# Altium schematic sheet connectors.SchDoc
size A
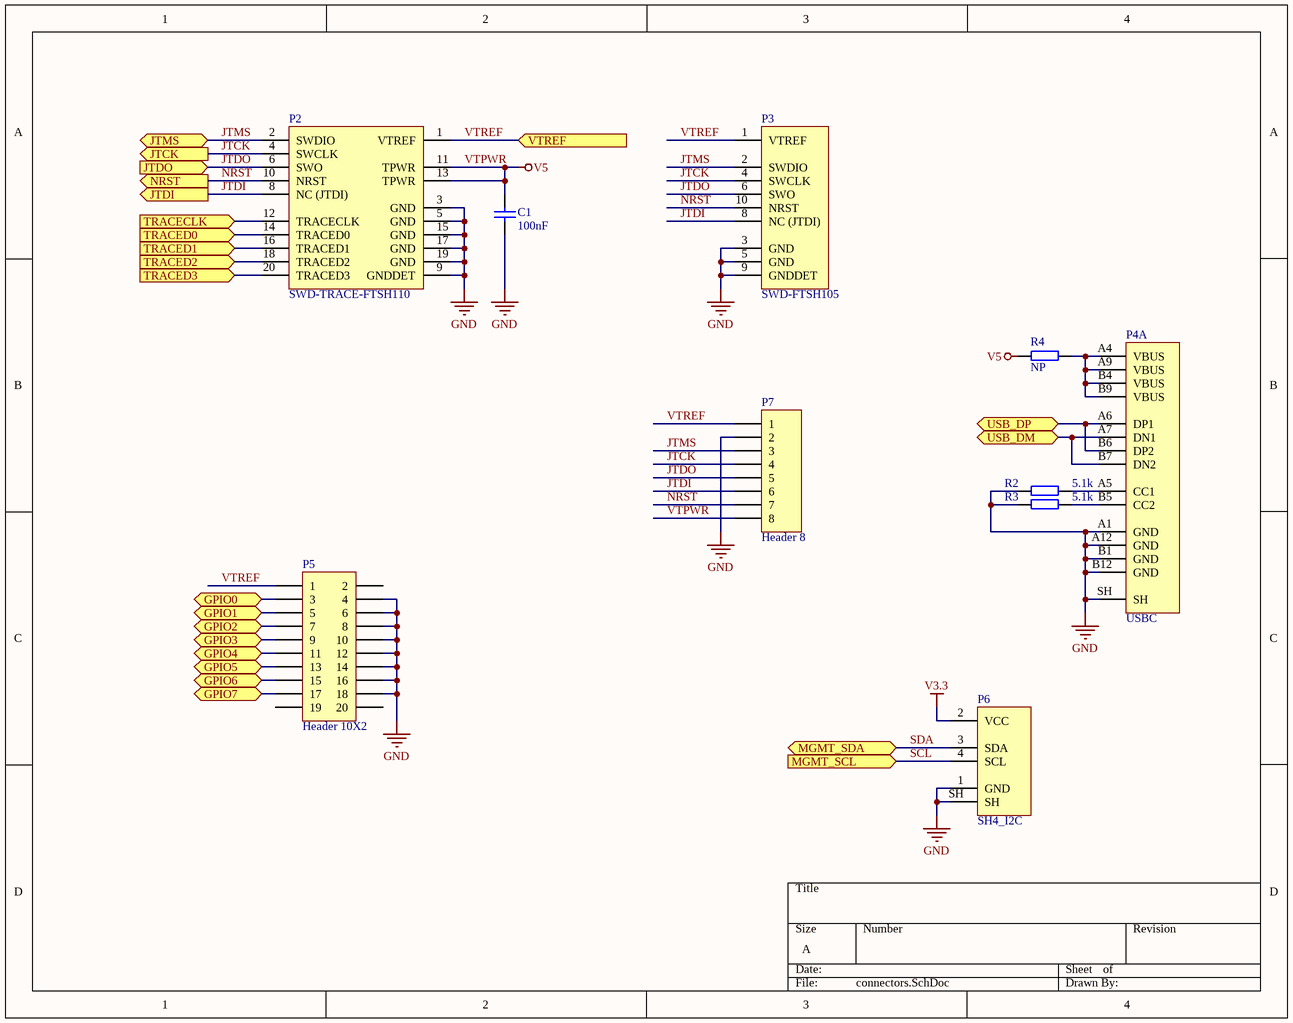
[diagram p0: connectors.SchDoc]

## Parts
C1  100nF  [0402]
P2  SWD-TRACE-FTSH110  [FTSH110]
P3  SWD-FTSH105  [FTSH105]
P4  USBC  [U262-161N-4BVC11]  (part A of 2)
P5  Header 10X2  [HDR2X10]
P6  SH4_I2C  [SM04B]
P7  Header 8  [HDR1X8]
R2  5.1k  [0402]
R3  5.1k  [0402]
R4  NP  [0402]

## Ports
GPIO0 (bidir), GPIO1 (bidir), GPIO2 (bidir), GPIO3 (bidir), GPIO4 (bidir), GPIO5 (bidir), GPIO6 (bidir), GPIO7 (bidir), JTCK (out), JTDI (out), JTDO (in), JTMS (bidir), MGMT_SCL (in), MGMT_SDA (bidir), NRST (out), TRACECLK (in), TRACED0 (in), TRACED1 (in), TRACED2 (in), TRACED3 (in), USB_DM, USB_DP, VTREF (in)

## Nets
GND: C1.1 P2.3(GND) P2.5(GND) P2.9(GNDDET) P2.15(GND) P2.17(GND) P2.19(GND) P3.3(GND) P3.5(GND) P3.9(GNDDET) P4.A1(GND) P4.A12(GND) P4.B1(GND) P4.B12(GND) P4.SH P5.4 P5.6 P5.8 P5.10 P5.12 P5.14 P5.16 P5.18 P6.1(GND) P6.SH P7.2 R2.1 R3.1
V3.3: P6.2(VCC)
VTPWR: C1.2 P2.11(TPWR) P2.13(TPWR) P7.8 R4.1  [also labelled V5]
GPIO0: P5.3 ; port GPIO0
GPIO1: P5.5 ; port GPIO1
GPIO2: P5.7 ; port GPIO2
GPIO3: P5.9 ; port GPIO3
GPIO4: P5.11 ; port GPIO4
GPIO5: P5.13 ; port GPIO5
GPIO6: P5.15 ; port GPIO6
GPIO7: P5.17 ; port GPIO7
JTCK: P2.4(SWCLK) P3.4(SWCLK) P7.4 ; port JTCK
JTDI: P2.8(NC_(JTDI)) P3.8(NC_(JTDI)) P7.6 ; port JTDI
JTDO: P2.6(SWO) P3.6(SWO) P7.5 ; port JTDO
JTMS: P2.2(SWDIO) P3.2(SWDIO) P7.3 ; port JTMS
NRST: P2.10(NRST) P3.10(NRST) P7.7 ; port NRST
SCL: P6.4(SCL) ; port MGMT_SCL
SDA: P6.3(SDA) ; port MGMT_SDA
TRACECLK: P2.12(TRACECLK) ; port TRACECLK
TRACED0: P2.14(TRACED0) ; port TRACED0
TRACED1: P2.16(TRACED1) ; port TRACED1
TRACED2: P2.18(TRACED2) ; port TRACED2
TRACED3: P2.20(TRACED3) ; port TRACED3
USB_DM: P4.A7(DN1) P4.B7(DN2) ; port USB_DM
USB_DP: P4.A6(DP1) P4.B6(DP2) ; port USB_DP
VTREF: P2.1(VTREF) P3.1(VTREF) P5.1 P7.1 ; port VTREF
NetP4_A4: P4.A4(VBUS) P4.A9(VBUS) P4.B4(VBUS) P4.B9(VBUS) R4.2
NetP4_A5: P4.A5(CC1) R2.2
NetP4_B5: P4.B5(CC2) R3.2

Not connected (* = marked no-connect by the designer): P5 2 19 20

## Library data of the parts
C1 = Capacitor: Value: 100nF
P4 = USBC: pin to pad: A2>none A3>none A10>none A11>none B2>none B3>none B10>none B11>none
P5 = Header 10X2: Header, 10-Pin, Dual row; LatestRevisionDate: 17-Jul-2002; LatestRevisionNote: Re-released for DXP Platform.; Publisher: Altium Limited
P6 = SH4_I2C: Qwiic / STEMMA QT Compatible
P7 = Header 8: Header, 8-Pin; LatestRevisionDate: 17-Jul-2002; LatestRevisionNote: Re-released for DXP Platform.; Publisher: Altium Limited
R2-R4 = Resistor
  R2 R3: Value: 5.1k
  R4: Value: NP